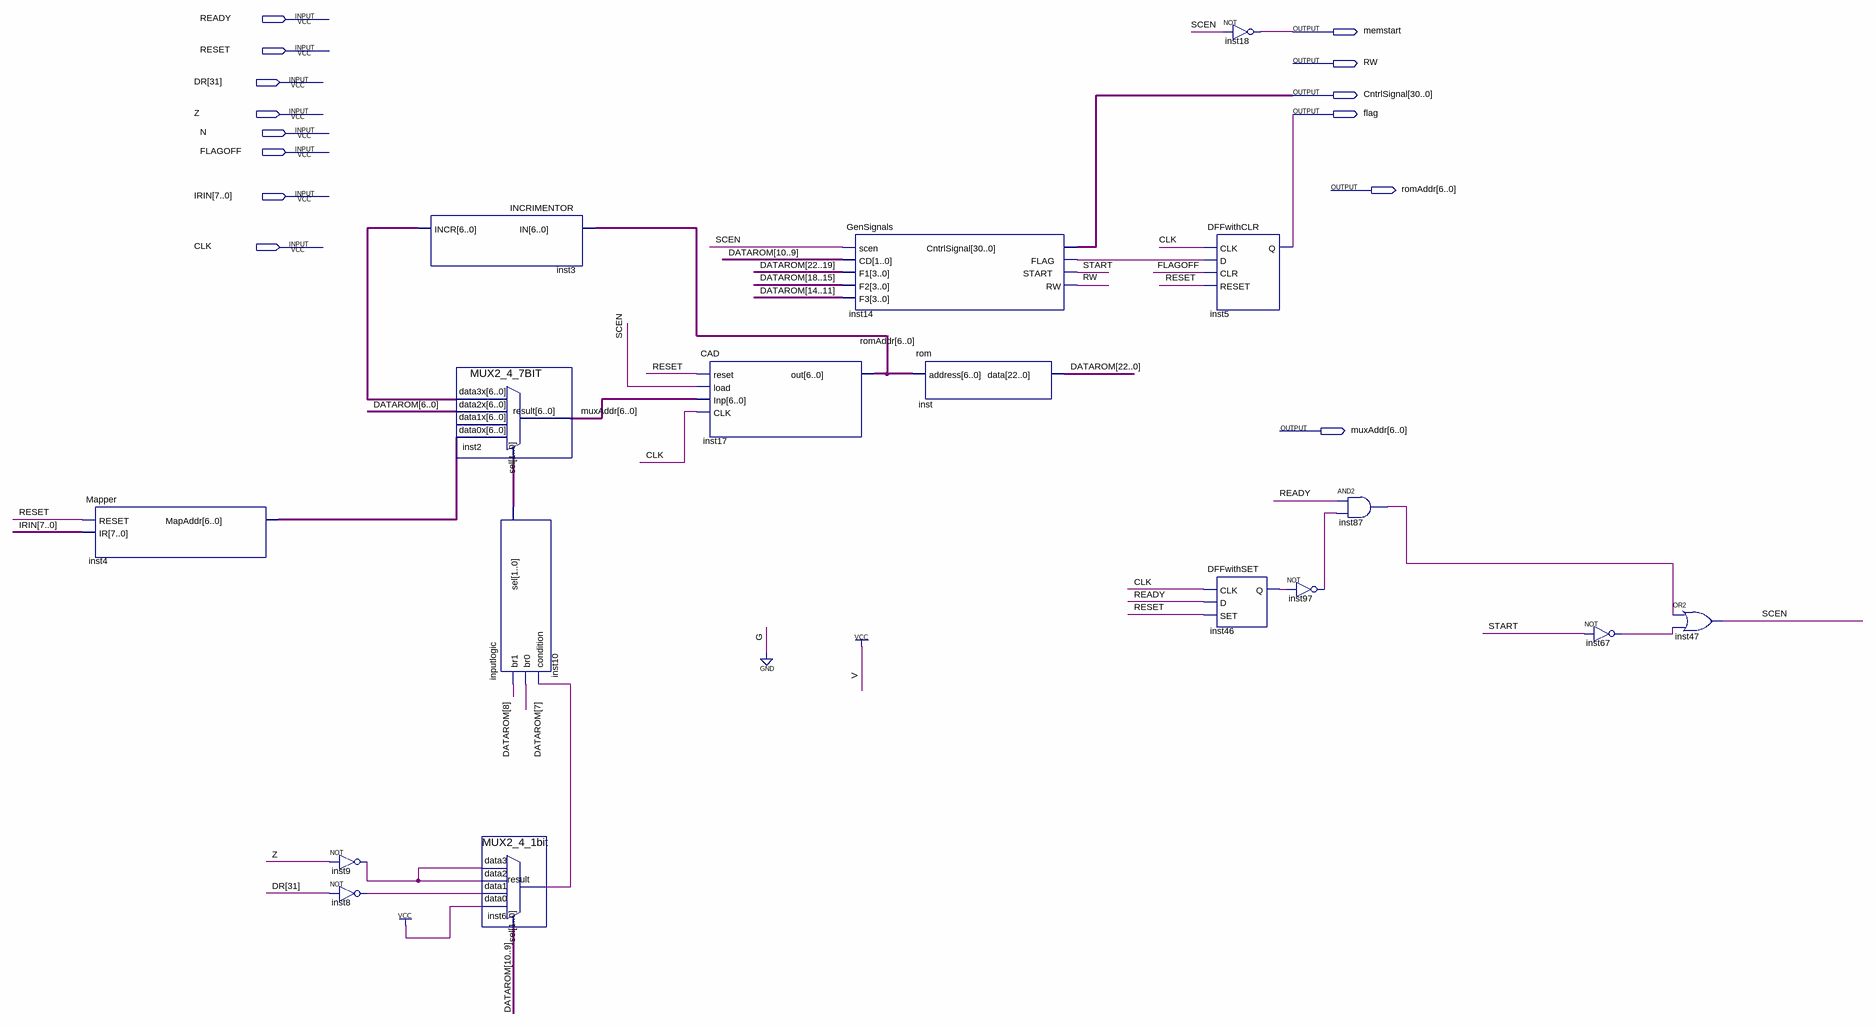
[diagram p0: schematic sheet]
// Quartus schematic DesignCPU.bdf as structural Verilog: 17 symbols, 14 pins
module DesignCPU (
  input  READY,
  input  RESET,
  input  [31:31] DR,
  input  Z,
  input  N,
  input  FLAGOFF,
  input  [7:0] IRIN,
  input  CLK,
  output memstart,
  output RW,
  output [30:0] CntrlSignal,
  output flag,
  output [6:0] romAddr,
  output [6:0] muxAddr
);

  wire inst6_result, inst8_out, inst9_out, inst14_flag, inst46_q, inst67_out, inst87_out, inst97_out, SCEN,
       START;
  wire [1:0] inst10_sel;
  wire [6:0] inst3_incr, inst4_mapaddr;
  wire [22:0] DATAROM;

  Mapper inst4 (.RESET(RESET), .IR(IRIN), .MapAddr(inst4_mapaddr));
  not inst9 (inst9_out, Z);
  not inst8 (inst8_out, DR[31]);
  INCRIMENTOR inst3 (.IN(romAddr), .INCR(inst3_incr));
  MUX2_4_7BIT inst2 (
    .data3x(inst3_incr), .data2x(DATAROM[6:0]), .data0x(inst4_mapaddr), .sel(inst10_sel), .result(muxAddr));  // open: data1x
  inputlogic inst10 (.br1(DATAROM[8]), .br0(DATAROM[7]), .condition(inst6_result), .sel(inst10_sel));
  MUX2_4_1bit inst6 (
    .data3(inst9_out), .data2(inst9_out), .data1(inst8_out), .data0(1'b1), .sel(DATAROM[10:9]),
    .result(inst6_result));
  CAD inst17 (.reset(RESET), .load(SCEN), .Inp(muxAddr), .CLK(CLK), .out(romAddr));
  GenSignals inst14 (
    .scen(SCEN), .CD(DATAROM[10:9]), .F1(DATAROM[22:19]), .F2(DATAROM[18:15]), .F3(DATAROM[14:11]),
    .CntrlSignal(CntrlSignal), .FLAG(inst14_flag), .START(START), .RW(RW));
  rom inst (.address(romAddr), .data(DATAROM));
  not inst18 (memstart, SCEN);
  DFFwithCLR inst5 (.CLK(CLK), .D(inst14_flag), .CLR(FLAGOFF), .RESET(RESET), .Q(flag));
  DFFwithSET inst46 (.CLK(CLK), .D(READY), .SET(RESET), .Q(inst46_q));
  not inst97 (inst97_out, inst46_q);
  and inst87 (inst87_out, READY, inst97_out);
  not inst67 (inst67_out, START);
  or inst47 (SCEN, inst87_out, inst67_out);
endmodule
